# EAGLE design mainboard (EAGLE 7.2.0)
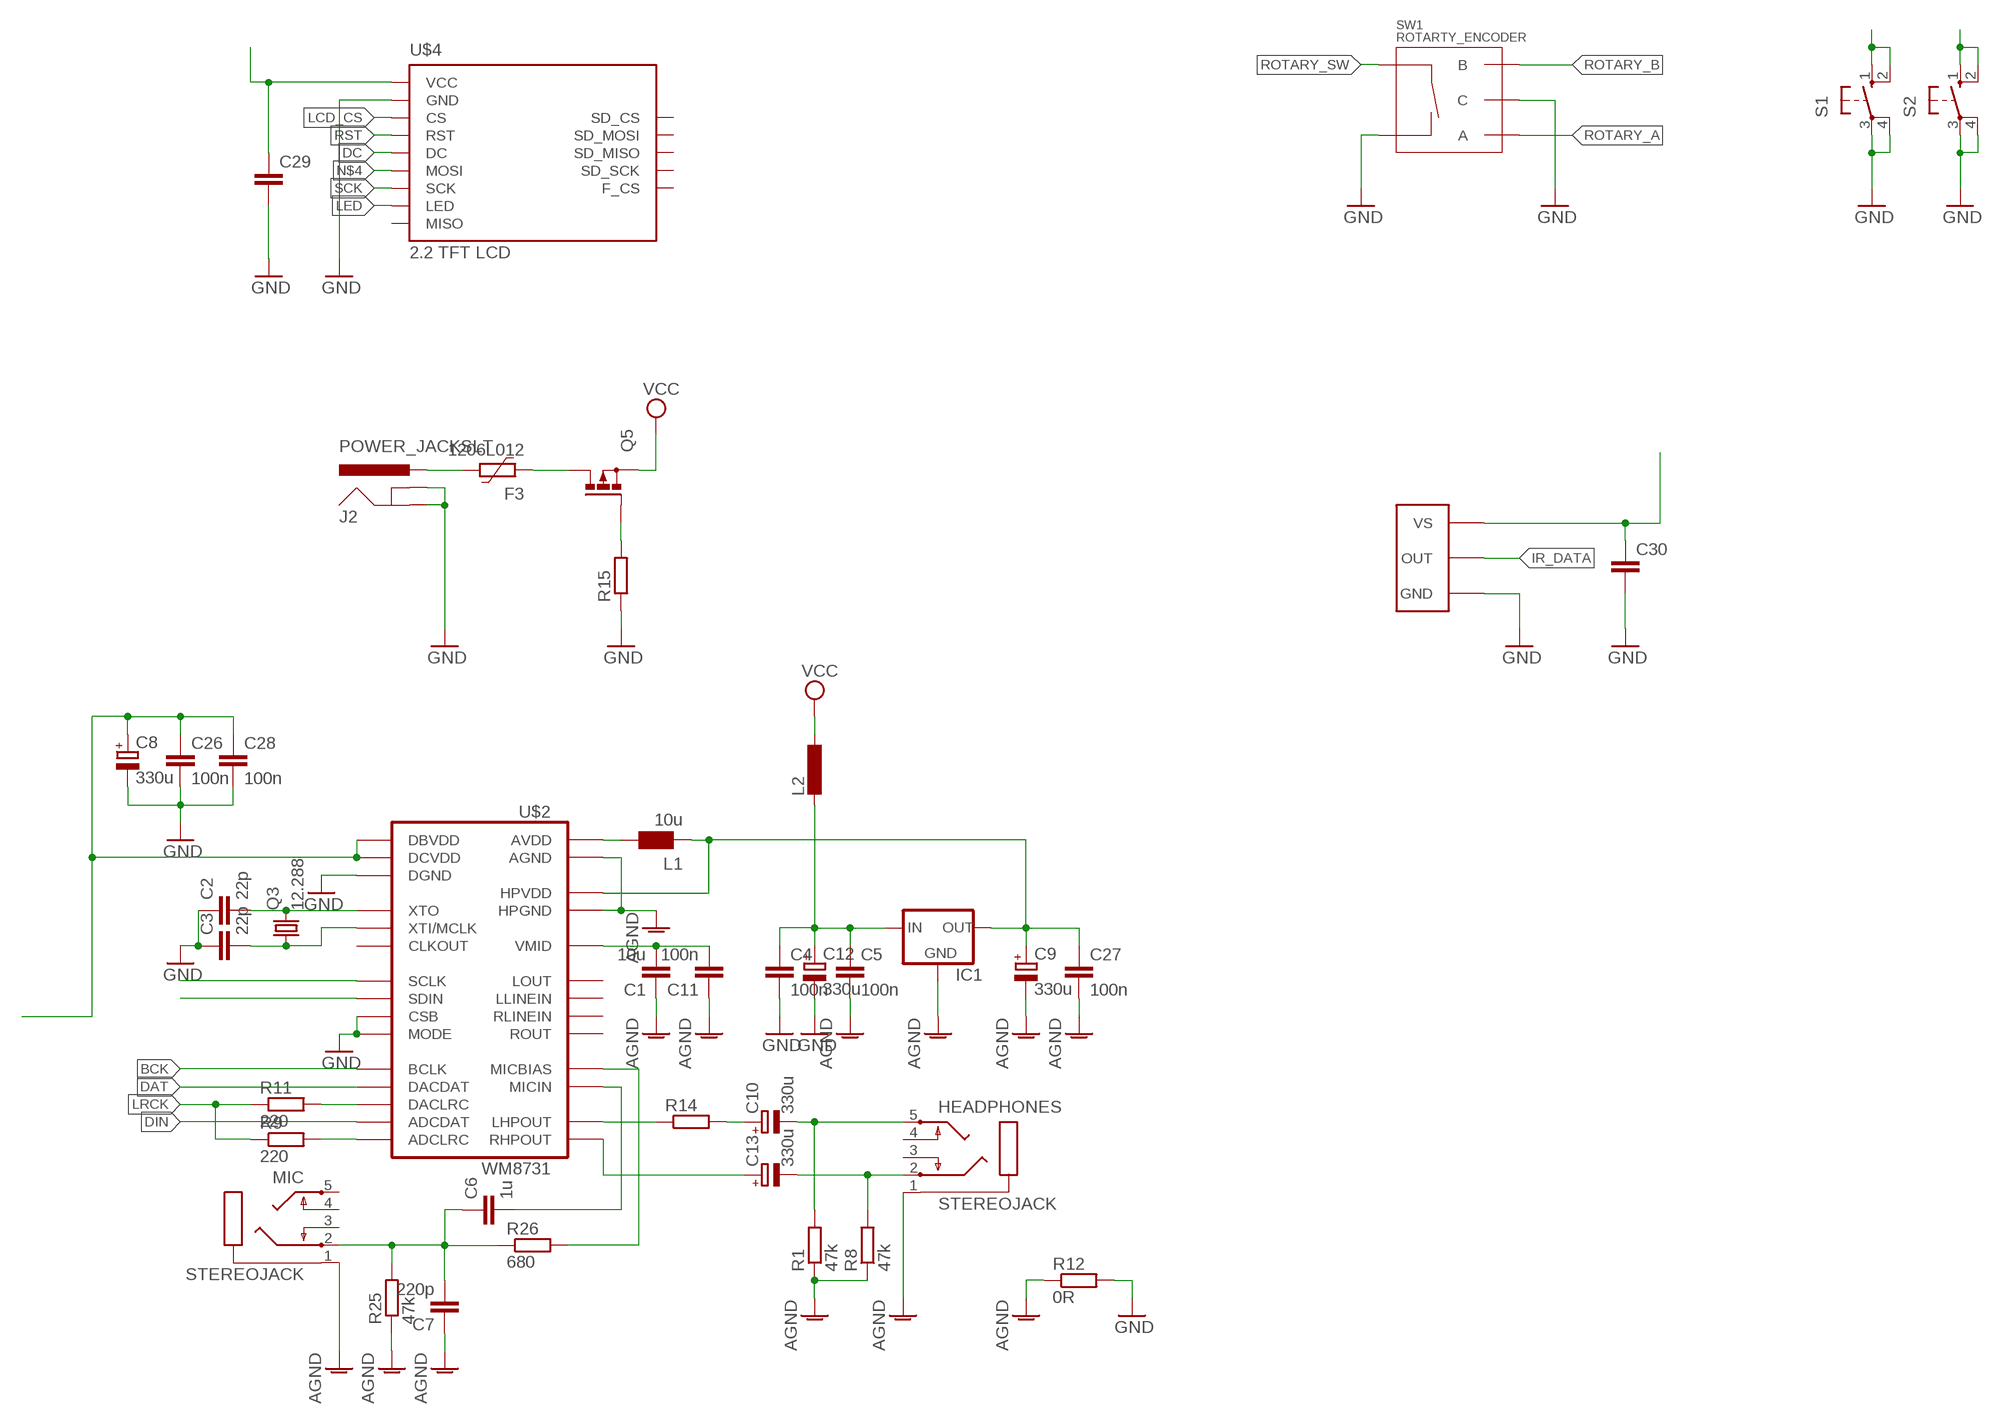
[diagram p0: schematic, sheet 1, part 1 of 2]
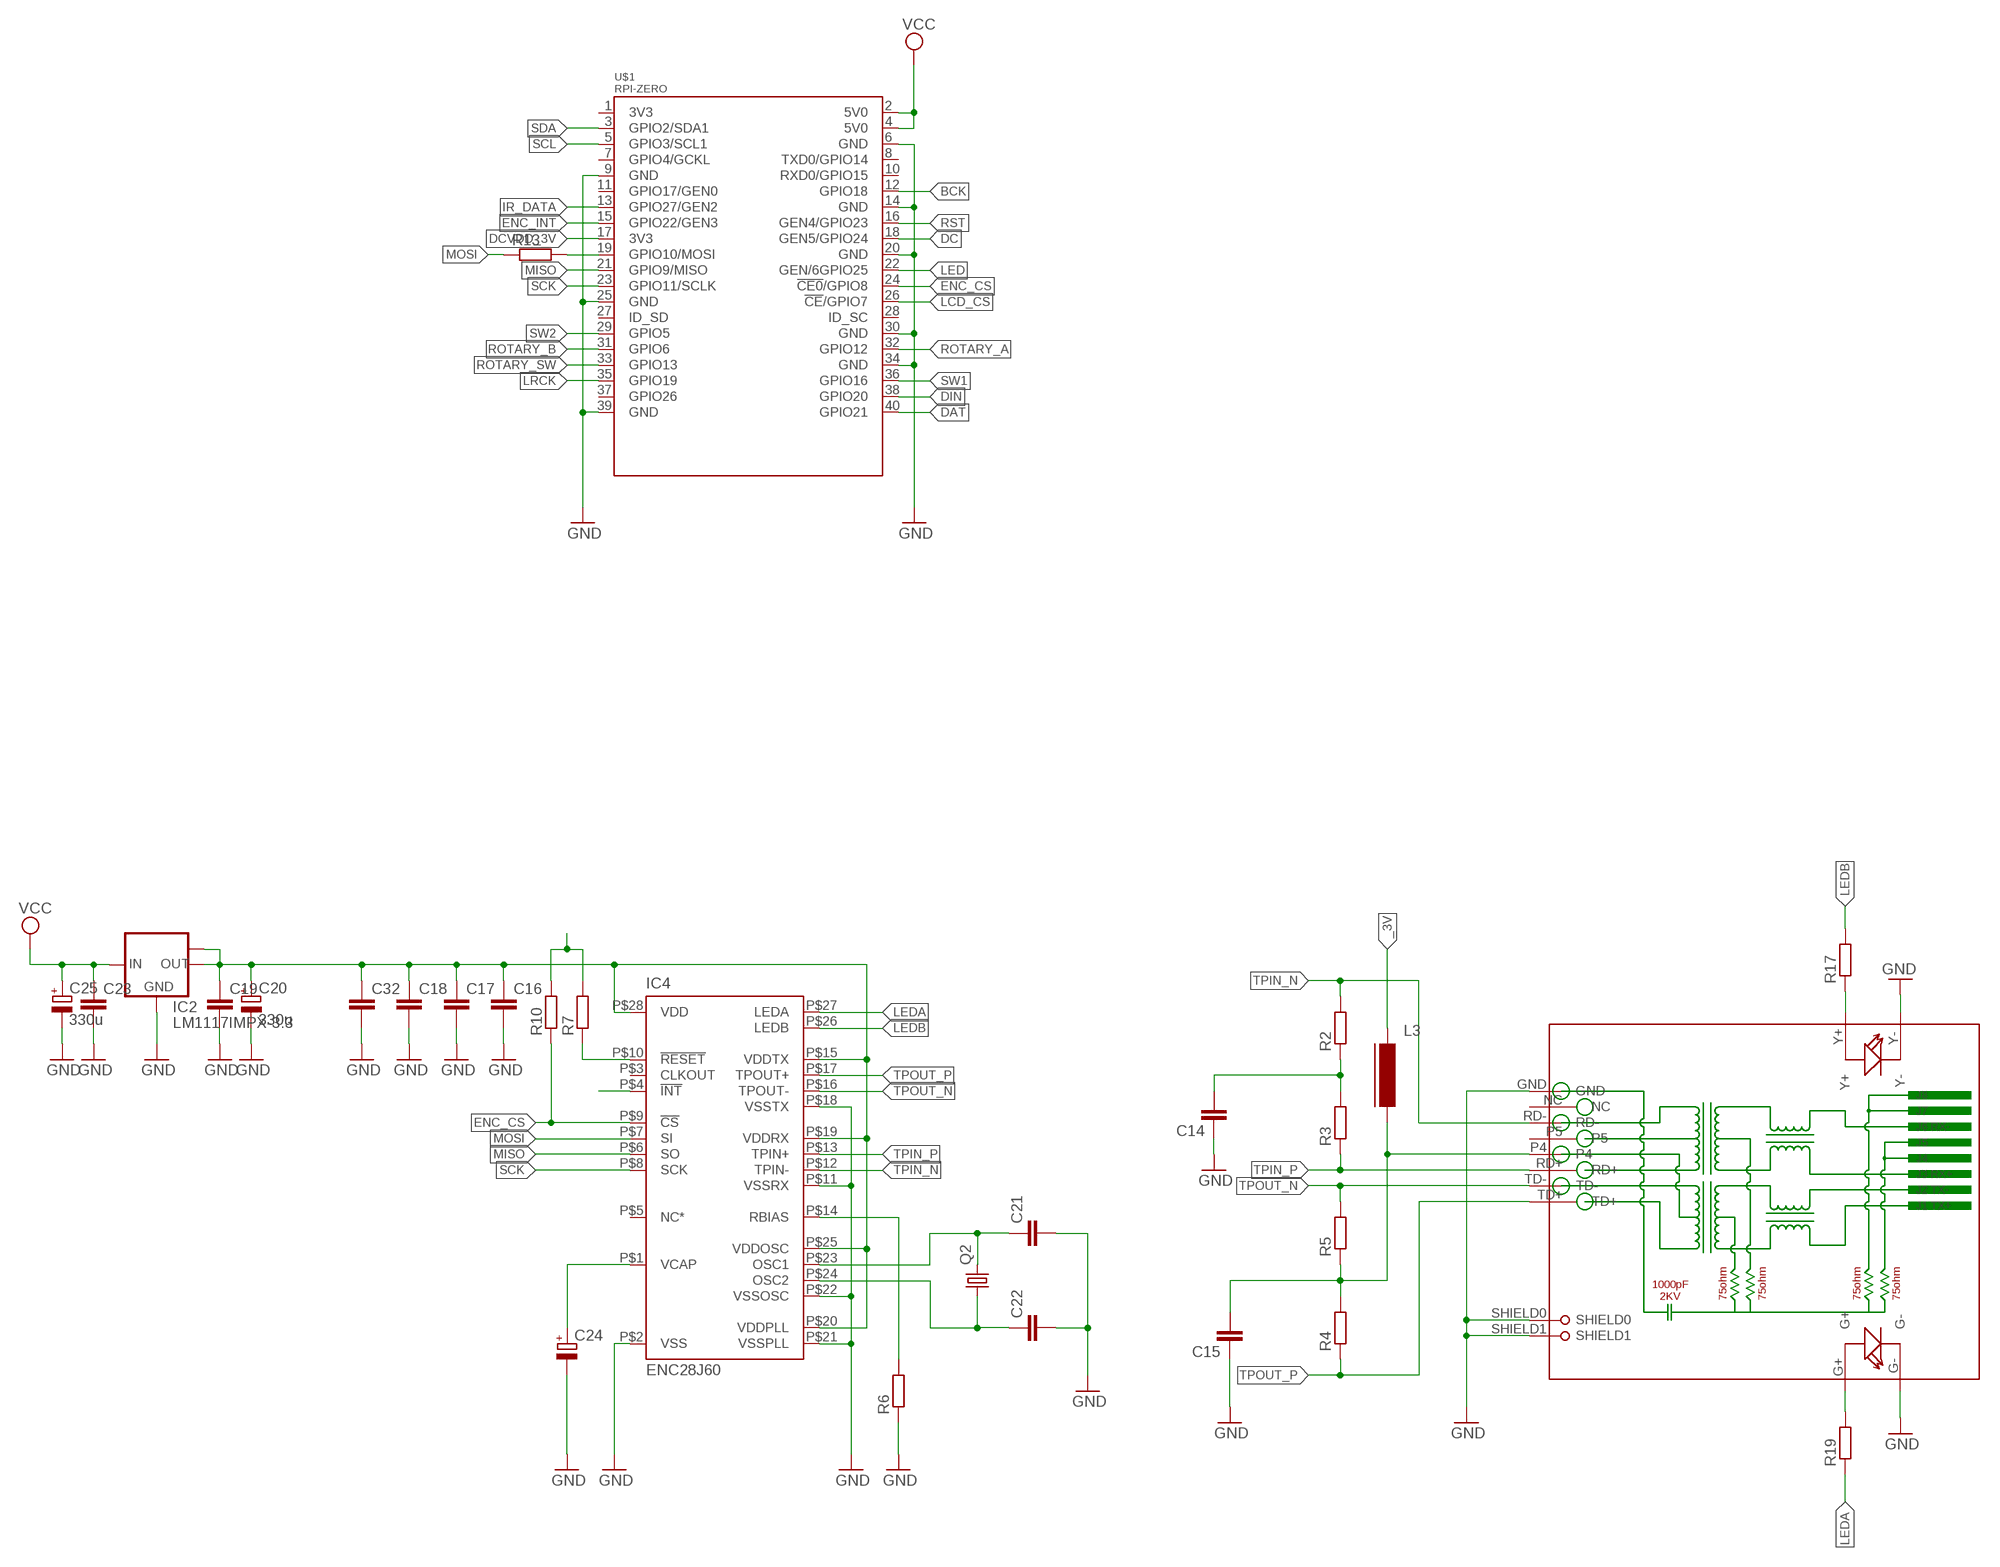
[diagram p1: schematic, sheet 1, part 2 of 2]

## Parts
C1  10u  C-EUC0603  [C0603]
C2  22p  C-EUC0603  [C0603]
C3  22p  C-EUC0603  [C0603]
C4  100n  C-EUC0603  [C0603]
C5  100n  C-EUC0603  [C0603]
C6  1u  C-EUC0603  [C0603]
C7  220p  C-EUC0603  [C0603]
C8  330u  CPOL-EUSMCB  [SMC_B]
C9  330u  CPOL-EUSMCB  [SMC_B]
C10  330u  CPOL-EUE3.5-8  [E3,5-8]
C11  100n  C-EUC0603  [C0603]
C12  330u  CPOL-EUSMCB  [SMC_B]
C13  330u  CPOL-EUE3.5-8  [E3,5-8]
C14  C-EUC0603  [C0603]
C15  C-EUC0603  [C0603]
C16  C-EUC0402  [C0402]
C17  C-EUC0402  [C0402]
C18  C-EUC0402  [C0402]
C19  C-EUC0603  [C0603]
C20  330u  CPOL-EUSMCB  [SMC_B]
C21  C-EUC0603  [C0603]
C22  C-EUC0603  [C0603]
C23  C-EUC0603  [C0603]
C24  CPOL-EUSMCA  [SMC_A]
C25  330u  CPOL-EUSMCB  [SMC_B]
C26  100n  C-EUC0603  [C0603]
C27  100n  C-EUC0603  [C0603]
C28  100n  C-EUC0603  [C0603]
C29  C-EUC0603  [C0603]
C30  C-EUC0603  [C0603]
C32  C-EUC0402  [C0402]
F3  1206L012  [1206L]
HEADPHONES  STEREOJACK  [STX3100]
IC1  78LXXREV  [78LXX_REV]
IC2  LM1117IMPX-3.3  [SOT223]
IC4  ENC28J60  [TSSOP28W]
J2  POWER_JACKSLT  [POWER_JACK_SLOT]
L1  10u  WE-KI_0805_B  [WE-KI_0805_B]
L2  L-EU0204/7  [0204/7]
L3  FERRITE-0805  [FB805]
MIC  STEREOJACK  [STX3100]
Q2  CRYSTALHC49S  [HC49/S]
Q3  12.288  CRYSTALHC49U70  [HC49U70]
Q5  P-MOSFET-SO8  [SO-08]
R1  47k  R-EU_R0603  [R0603]
R2  R-EU_R0603  [R0603]
R3  R-EU_R0603  [R0603]
R4  R-EU_R0603  [R0603]
R5  R-EU_R0603  [R0603]
R6  R-EU_0204/7  [0204/7]
R7  R-EU_0204/7  [0204/7]
R8  47k  R-EU_R0603  [R0603]
R9  220  R-EU_R0402  [R0402]
R10  R-EU_0204/5  [0204/5]
R11  220  R-EU_R0603  [R0603]
R12  0R  R-EU_R0805  [R0805]
R13  R-EU_R0603  [R0603]
R14  R-EU_R1206  [R1206]
R15  R-EU_R0603  [R0603]
R17  R-EU_R0603  [R0603]
R19  R-EU_R0603  [R0603]
R25  47k  R-EU_R0603  [R0603]
R26  680  R-EU_R0603  [R0603]
RJ1  HR911105A  [HR911105A]
S1  40-XX  [B3F-40XX]
S2  40-XX  [B3F-40XX]
SW1  ROTARTY_ENCODER  [ROTARY_ENC_PLAIN]
U$1  RPI-ZERO  [RASPBERRYPI_BASTELSTUBE_V13_RASPI_BOARD_B+_FULL]
U$2  WM8731  [28-SSOP]
U$4  2.2_TFT_LCD  [2.2_TFT_LCD]
U$5  TSOP312XVERTICAL  [TSOP312X_VERT]

## Nets
_3V: C16.1 C17.1 C18.1 C19.1 C20.+ C29.1 C30.1 C32.1 IC2.2(OUT) IC2.TAB(OUT1) IC4.P$15(VDDTX) IC4.P$19(VDDRX) IC4.P$20(VDDPLL) IC4.P$25(VDDOSC) IC4.P$28(VDD) L3.1 U$4.VCC U$5.2(VS)
AGND: C1.1 C5.2 C7.1 C9.- C11.1 C27.2 HEADPHONES.1 IC1.GND MIC.1 R1.1 R8.1 R12.1 R25.1 U$2.P$11(HPGND) U$2.P$15(AGND)
BCK: U$1.12(GPIO18) U$2.P$3(BCLK)
DAT: U$1.40(GPIO21) U$2.P$4(DACDAT)
DC: U$1.18(GEN5/GPIO24) U$4.DC
DCVDD_3V: C8.+ C26.1 C28.1 R7.2 R10.2 U$1.17(3V3) U$2.P$1(DBVDD) U$2.P$27(DCVDD)
DIN: U$1.38(GPIO20) U$2.P$6(ADCDAT)
ENC_CS: IC4.P$9(!CS) R10.1 U$1.24(!CE0!/GPIO8)
ENC_INT: IC4.P$4(!INT) U$1.15(GPIO22/GEN3)
ENC_RST: IC4.P$10(!RESET) R7.1
GND: C2.1 C3.1 C4.2 C8.- C12.- C14.1 C15.1 C16.2 C17.2 C18.2 C19.2 C20.- C21.2 C22.2 C23.2 C24.- C25.- C26.2 C28.2 C29.2 C30.2 C32.2 IC2.1(GND) IC4.P$2(VSS) IC4.P$11(VSSRX) IC4.P$18(VSSTX) IC4.P$21(VSSPLL) IC4.P$22(VSSOSC) J2.GND@1(GNDBREAK) J2.GND@2(GND) R6.1 R12.2 R15.1 RJ1.G- RJ1.GND RJ1.SHIELD0 RJ1.SHIELD1 RJ1.Y- S1.3(P) S1.4(P1) S2.3(P) S2.4(P1) SW1.C SW1.SW- U$1.6(GND) U$1.9(GND) U$1.14(GND) U$1.20(GND) U$1.25(GND) U$1.30(GND) U$1.34(GND) U$1.39(GND) U$2.P$21(MODE) U$2.P$22(CSB) U$2.P$28(DGND) U$4.GND U$5.1(GND)
IR_DATA: U$1.13(GPIO27/GEN2) U$5.3(OUT)
LCD_CS: U$1.26(!CE!/GPIO7) U$4.CS
LED: U$1.22(GEN/6GPIO25) U$4.LED
LEDA: IC4.P$27(LEDA) R19.1
LEDB: IC4.P$26(LEDB) R17.2
LRCK: R9.1 R11.1 U$1.35(GPIO19)
MISO: IC4.P$6(SO) U$1.21(GPIO9/MISO)
MOSI: IC4.P$7(SI) R13.1
N$1: R26.2 U$2.P$17(MICBIAS)
N$2: C14.2 R2.1 R3.2
N$3: R14.1 U$2.P$9(LHPOUT)
N$4: R13.2 U$1.19(GPIO10/MOSI) U$4.MOSI
N$5: F3.2 Q5.5(D) Q5.6(D) Q5.7(D) Q5.8(D)
N$6: C15.2 L3.2 R4.2 R5.1 RJ1.P4
N$7: C4.1 C5.1 C12.+ IC1.IN L2.2
N$8: C10.+ R14.2
N$9: F3.1 J2.PWR
N$11: C2.2 Q3.2 U$2.P$26(XTO)
N$12: IC4.P$14(RBIAS) R6.2
N$13: C3.2 Q3.1 U$2.P$25(XTI/MCLK)
N$14: C10.- HEADPHONES.5 R1.2
N$22: C21.1 IC4.P$23(OSC1) Q2.2
N$23: C22.1 IC4.P$24(OSC2) Q2.1
N$26: Q5.4(G) R15.2
N$29: C24.+ IC4.P$1(VCAP)
N$30: R17.1 RJ1.Y+
N$31: R19.2 RJ1.G+
N$34: C9.+ C27.1 IC1.OUT L1.2 U$2.P$8(HPVDD)
N$40: R11.2 U$2.P$5(DACLRC)
N$42: R9.2 U$2.P$7(ADCLRC)
N$44: C1.2 C11.2 U$2.P$16(VMID)
N$45: C13.- HEADPHONES.2 R8.2
N$46: L1.1 U$2.P$14(AVDD)
N$53: C13.+ U$2.P$10(RHPOUT)
N$54: C6.2 U$2.P$18(MICIN)
N$55: C6.1 C7.2 MIC.2 R25.2 R26.1
ROTARY_A: SW1.A U$1.32(GPIO12)
ROTARY_B: SW1.B U$1.31(GPIO6)
ROTARY_SW: SW1.SW+ U$1.33(GPIO13)
RST: U$1.16(GEN4/GPIO23) U$4.RST
SCK: IC4.P$8(SCK) U$1.23(GPIO11/SCLK) U$4.SCK
SCL: U$1.5(GPIO3/SCL1) U$2.P$24(SCLK)
SDA: U$1.3(GPIO2/SDA1) U$2.P$23(SDIN)
SW1: S1.1(S) S1.2(S1) U$1.36(GPIO16)
SW2: S2.1(S) S2.2(S1) U$1.29(GPIO5)
TPIN_N: IC4.P$12(TPIN-) R2.2 RJ1.RD-
TPIN_P: IC4.P$13(TPIN+) R3.1 RJ1.RD+
TPOUT_N: IC4.P$16(TPOUT-) R5.2 RJ1.TD-
TPOUT_P: IC4.P$17(TPOUT+) R4.1 RJ1.TD+
VCC: C23.1 C25.+ IC2.3(IN) L2.1 Q5.1(S) Q5.2(S) Q5.3(S) U$1.2(5V0) U$1.4(5V0)
Unconnected: HEADPHONES.3 HEADPHONES.4 IC4.P$3(CLKOUT) IC4.P$5(NC*) MIC.3 MIC.4 MIC.5 RJ1.NC RJ1.P5 U$1.1(3V3) U$1.7(GPIO4/GCKL) U$1.8(TXD0/GPIO14) U$1.10(RXD0/GPIO15) U$1.11(GPIO17/GEN0) U$1.27(ID_SD) U$1.28(ID_SC) U$1.37(GPIO26) U$2.P$2(CLKOUT) U$2.P$12(LOUT) U$2.P$13(ROUT) U$2.P$19(RLINEIN) U$2.P$20(LLINEIN) U$4.F_CS U$4.MISO U$4.SD_CS U$4.SD_MISO U$4.SD_MOSI U$4.SD_SCK

## Library data of the parts
C1-C7 C11 C14-C19 C21-C23 C26-C30 C32 = rcl:C-EU: CAPACITOR, European symbol
C8-C10 C12 C13 C20 C24 C25 = rcl:CPOL-EU: POLARIZED CAPACITOR, European symbol
F3 = polyfuse-smd_10:?: Polyfuse Resettable PTC Source: http://www.littelfuse.com/products/resettable-ptcs.aspx; MF: Littelfuse; MPN: 1206L012; OC_FARNELL: 1596988; OC_NEWARK: 05M2298
HEADPHONES MIC = adafruit:STEREOJACK: MIC/HEADPHONE JACK Stereo jack with two switches. Kycon STX3100, CUI SJ1-3555NG and/or 4UCon 05544
IC1 = v-reg:78LXX: VOLTAGE REGULATOR
IC2 = lm1117:LM1117IMPX-*
IC4 = microchip:ENC28J60: Stand-Alone Ethernet Controller with SPI Interface Source: http://ww1.microchip.com/downloads/en/DeviceDoc/39662c.pdf
J2 = SparkFun-Connectors:POWER_JACK: Power Jack This is the standard 5.5mm barrel jack for power. The PTH is the most common, proven, reliable, footprint. The Slot footprint only works if the mill layer is transmitted to the PCB fab house so be warned. Mating wall wart : TOL-00298 (and others); PROD_ID: PRT-00119
L1 = wuerth-elektronik:WE-KI: SMD Wire Wound Ceramic Inductor WE-KI - Wire wound - High thermal stability - Rated current up to 1 A - High Q-factor - High SRF -- Especially developed for high frequency applications -- Perfect for applications in telecommunications -- Bluetooth -- Wireless LAN
L2 = rcl:L-EU: INDUCTOR, European symbol
L3 = dp_devices:FERRITE: Ferrite bead in various packages
Q2 = crystal:CRYSTAL: CRYSTAL; OC_FARNELL: 1667008; OC_NEWARK: unknown
Q3 = crystal:CRYSTAL: CRYSTAL; OC_FARNELL: unknown; OC_NEWARK: unknown
Q5 = transistor-power:P-MOSFET-SO8: P-Channel MOSFET Example: FDS4435A; P-Channel Logic Level PowerTrench® MOSFET FDS4465; P-Channel 1.8V Specified PowerTrench® MOSFET Source: www.fairchildsemi.com
R1-R15 R17 R19 R25 R26 = rcl:R-EU_: RESISTOR, European symbol
RJ1 = hanrun:HR911105A
S1 S2 = switch-omron:40-XX: OMRON SWITCH; MF: OMRON COMPONENTS USA; MPN: B3F-4000; OC_FARNELL: 176434; OC_NEWARK: 36K3105
SW1 = SparkFun-Electromechanical:ROTARTY_ENCODER: Simple no LED rotary encoder Example: COM-09117
U$1 = RPI-Zero:RPI-ZERO
U$2 = microdecv1:WM8731
U$4 = aldar:2.2_TFT_LCD
U$5 = Simplex-ICs:TSOP312X: TSOP ir receiver module for remote control systems

## Board
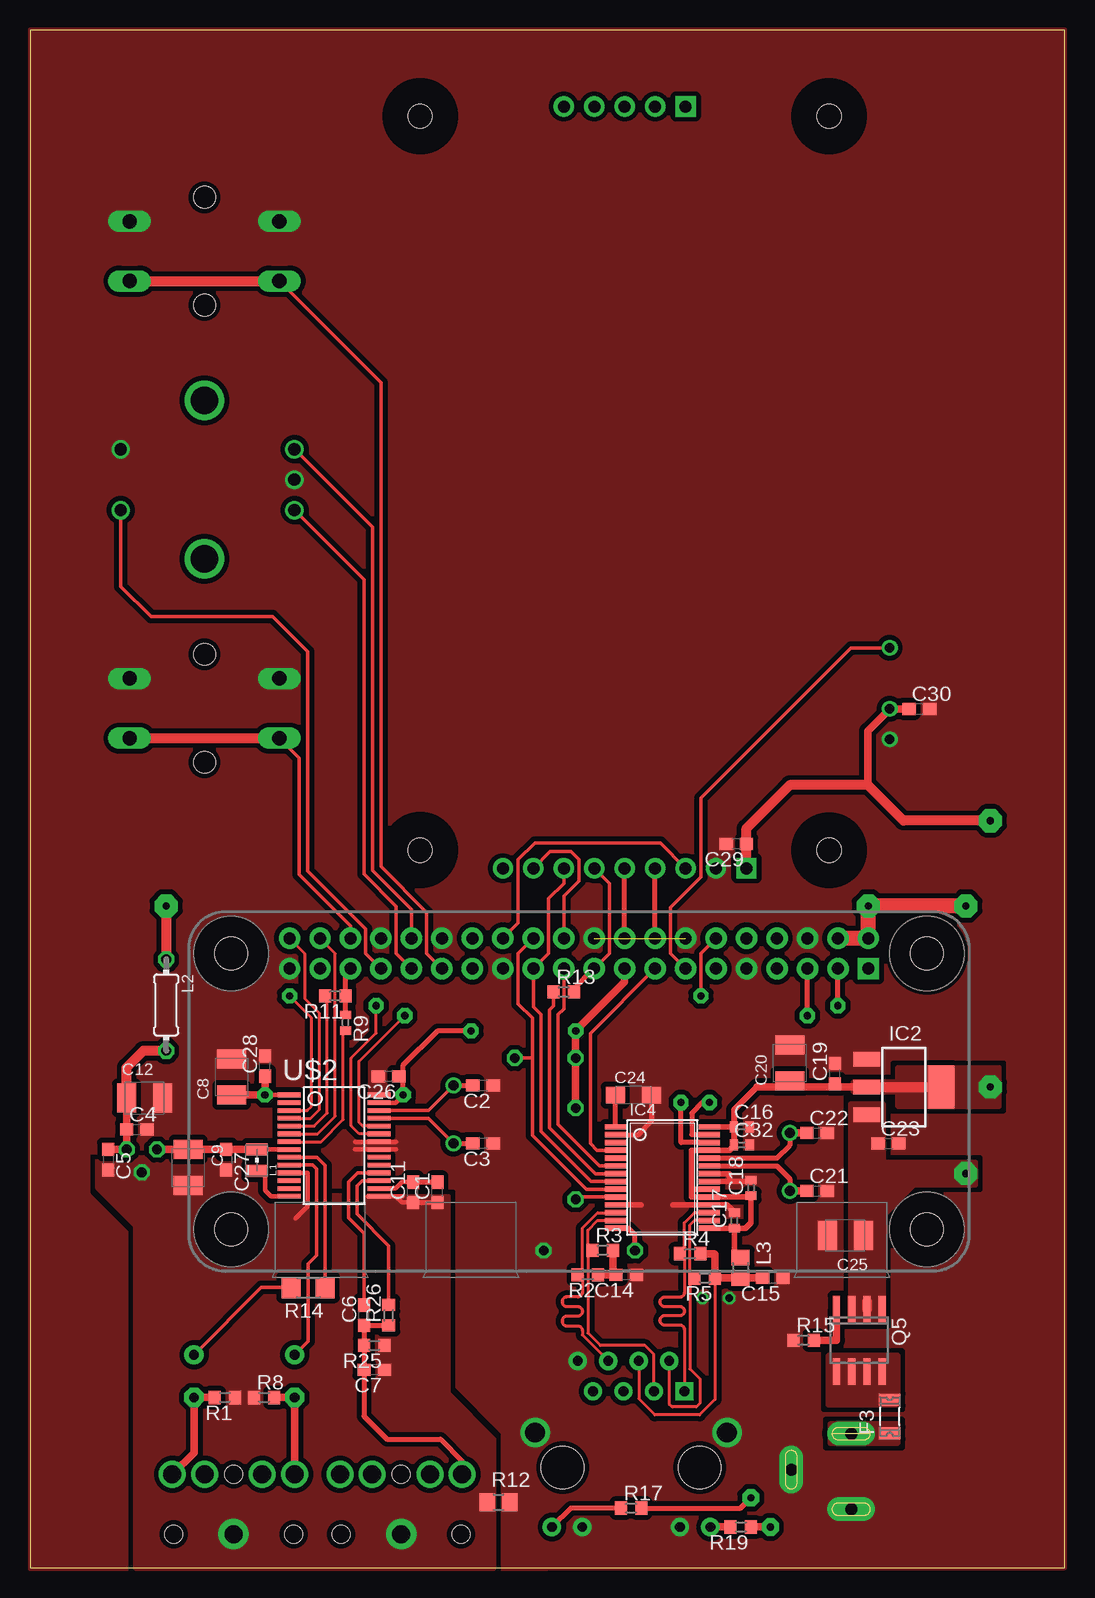
[diagram p2: board, top side]
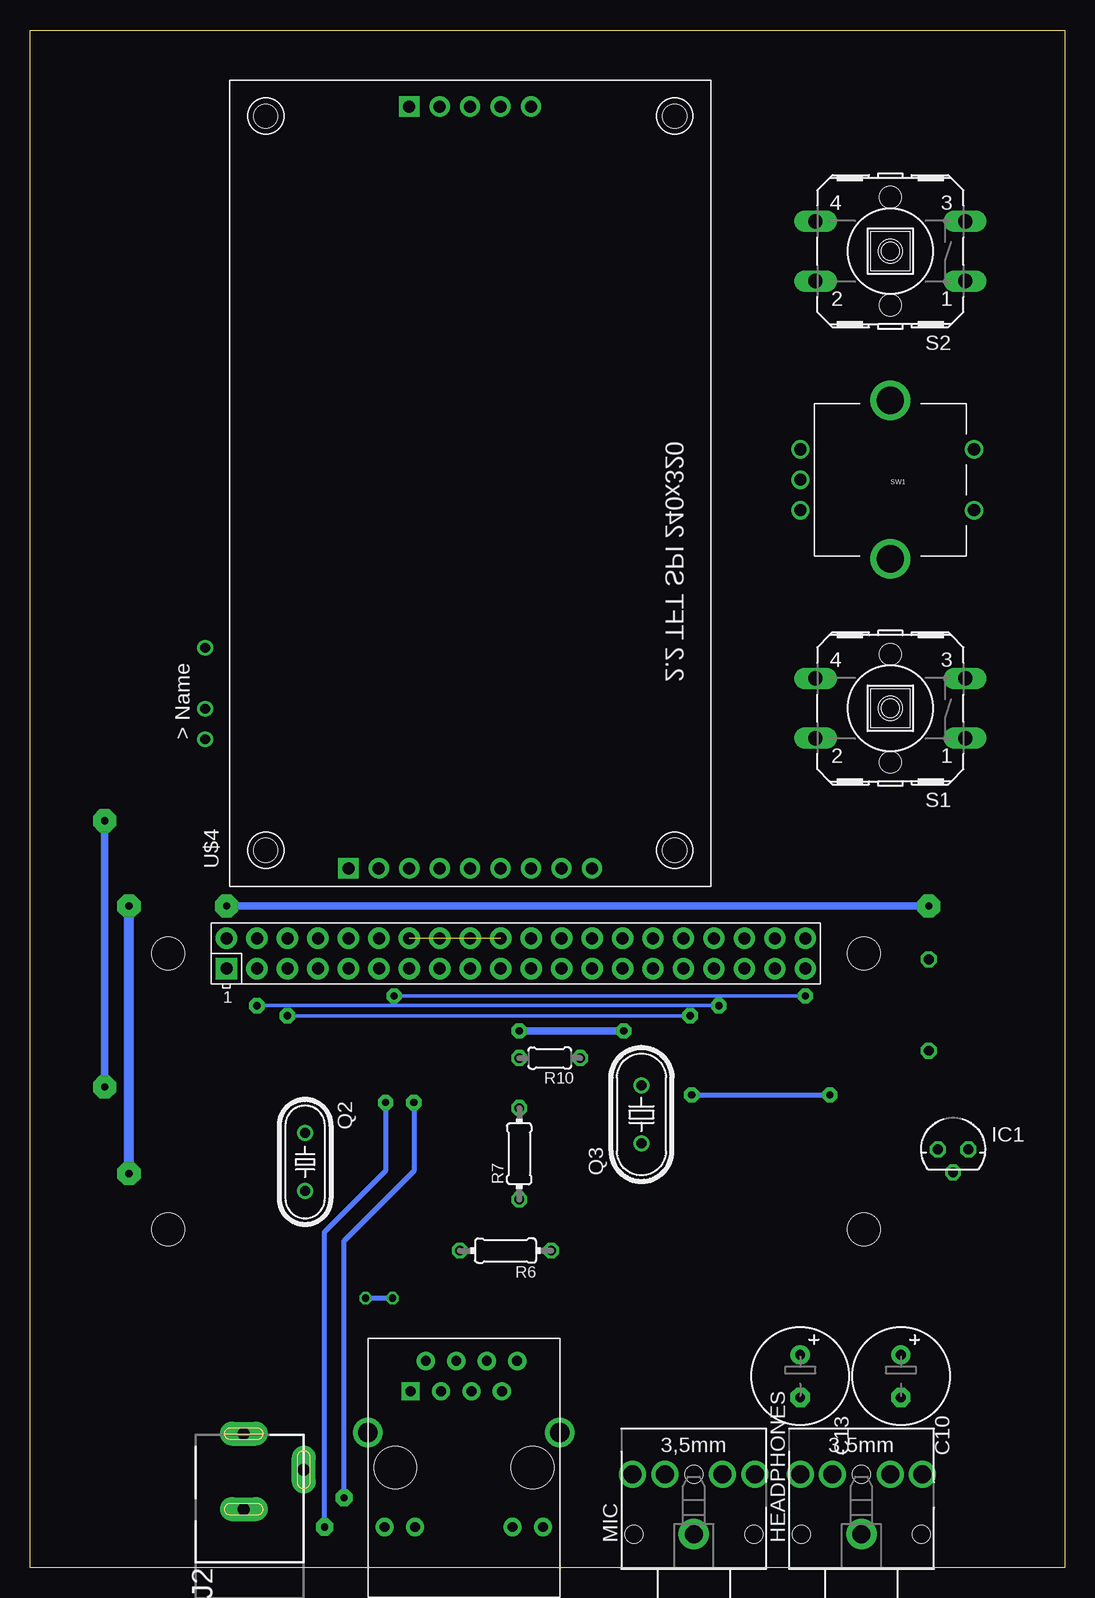
[diagram p3: board, bottom side, seen from below]

Size 86.28 x 128.18 mm. Coordinates in mm from the lower left corner, seen from the top.
Outline: 86.28,128.18 0,128.18 0,0 86.28,0 86.28,128.18
Copper layers (1*16): Top 0.035mm / dielectric 1.5mm / Bottom 0.035mm
Design rules "default *": minimum track width 10mil, minimum drill 24mil, track to track 8mil, track to pad 8mil, pad to pad 8mil, via to via 8mil, smd to smd 8mil, copper to edge 0mil, drill to drill 8mil, minimum pad ring 10mil, minimum via ring 8mil, stop-mask expansion 4mil, vias tented up to drill 0mil, thermal gap 10mil
tRestrict: area 55.8,28.1 to 57.6,37; area 47.9,28.1 to 49.7,37; area 72.2,25.6 to 77.3,30.7; area 72,48.4 to 77.6,54; area 14.2,48.7 to 19.3,53.7; area 14.2,25.6 to 19.3,30.7; area 30,57.3 to 35.1,62.4; area 30,118.5 to 35.1,123.5; area 64.1,118.5 to 69.2,123.5; area 64.1,57.3 to 69.2,62.3

### Footprints (pad centres in the part's own frame; a part is rotated, then mirrored left to right if it is on the bottom)
C0603 = smd 1.1 x 1: 1 -0.85,0; 2 0.85,0
SMC_B = smd 1.6 x 2.4: + -1.5,0; - 1.5,0
E3,5-8 = drill 0.813 pad 1.6: + -1.778,0 | drill 0.813 pad 1.6 octagon: - 1.778,0
C0402 = smd 0.7 x 0.9: 1 -0.65,0; 2 0.65,0
SMC_A = smd 1.6 x 1.4: + -1.5,0; - 1.5,0
1206L = smd 1 x 1.8: 1 -1.4,0; 2 1.4,0
STX3100 = drill 1.5 pad 2.54: 1 2.7,-0.1 | drill 1.5: 2 7.7,5; 3 7.7,2.3; 4 7.7,-2.5; 5 7.7,-5.2 | hole 1.5: 2.7,4.9; 2.7,-5.1; 7.7,-0.1
78LXX_REV = drill 0.813 octagon: GND 0,-1.905; IN 1.27,0; OUT -1.27,0
SOT223 = smd 1.219 x 2.235: 1 -2.311,-3.099; 2 0,-3.099; 3 2.311,-3.099 | smd 3.6 x 2.2: TAB 0,3.099
TSSOP28W = smd 0.45 x 1.75: P$1 0,-0.65; P$2 0.65,-0.65; P$3 1.3,-0.65; P$4 1.95,-0.65; P$5 2.6,-0.65; P$6 3.25,-0.65; P$7 3.9,-0.65; P$8 4.55,-0.65; P$9 5.2,-0.65; P$10 5.85,-0.65; P$11 6.5,-0.65; P$12 7.15,-0.65; P$13 7.8,-0.65; P$14 8.45,-0.65; P$15 8.45,7.2; P$16 7.8,7.2; P$17 7.15,7.2; P$18 6.5,7.2; P$19 5.85,7.2; P$20 5.2,7.2; P$21 4.55,7.2; P$22 3.9,7.2; P$23 3.25,7.2; P$24 2.6,7.2; P$25 1.95,7.2; P$26 1.3,7.2; P$27 0.65,7.2; P$28 0,7.2
POWER_JACK_SLOT = drill 1 pad 2 long: GND@1 2.58,7.5; GND@2 7.58,10.8; PWR 2.58,13.8
WE-KI_0805_B = smd 1.02 x 1.78: 1 -0.89,0; 2 0.89,0
0204/7 = drill 0.813 octagon: 1 -3.81,0; 2 3.81,0
FB805 = smd 1.3 x 1.5: 1 -0.85,0; 2 0.85,0
HC49/S = drill 0.813: 1 -2.413,0; 2 2.413,0
HC49U70 = drill 0.813: 1 -2.413,0; 2 2.413,0
SO-08 = smd 0.6 x 2.2: 1 -1.905,-2.6; 2 -0.635,-2.6; 3 0.635,-2.6; 4 1.905,-2.6; 5 1.905,2.6; 6 0.635,2.6; 7 -0.635,2.6; 8 -1.905,2.6
R0603 = smd 1 x 1.1: 1 -0.85,0; 2 0.85,0
R0402 = smd 0.7 x 0.9: 1 -0.65,0; 2 0.65,0
0204/5 = drill 0.813 octagon: 1 -2.54,0; 2 2.54,0
R0805 = smd 1.3 x 1.5: 1 -0.95,0; 2 0.95,0
R1206 = smd 1.6 x 1.803: 1 -1.422,0; 2 1.422,0
HR911105A = drill 0.813 pad 1.524: G+ 4.953,-6.604; G- 4.953,-4.064; GND -8.89,4.445; NC -6.35,3.175; P4 -8.89,-0.635; P5 -6.35,0.635; RD+ -6.35,-1.905; RD- -8.89,1.905; TD- -8.89,-3.175; Y+ 4.953,6.604; Y- 4.953,4.064 | drill 1.651 pad 2.159: SHIELD0 -2.921,8.001; SHIELD1 -2.921,-8.001 | drill 0.813 pad 1.524 square: TD+ -6.35,-4.445 | hole 3.556: 0,-5.715; 0,5.715
B3F-40XX = drill 1.194 long: 1 -6.248,2.489; 2 6.248,2.489; 3 -6.248,-2.489; 4 6.248,-2.489 | hole 1.803: 0,-4.496; 0,4.496
ROTARY_ENC_PLAIN = drill 1.016: A 7.493,-2.54; B 7.493,2.54; C 7.493,0; SW+ -6.985,2.54; SW- -6.985,-2.54 | drill 2.286: P$3 0,6.604; P$4 0,-6.604
RASPBERRYPI_BASTELSTUBE_V13_RASPI_BOARD_B+_FULL = drill 1 pad 1.778 square: 1 8.37,25.23 | drill 1 pad 1.778: 2 8.37,27.77; 3 10.91,25.23; 4 10.91,27.77; 5 13.45,25.23; 6 13.45,27.77; 7 15.99,25.23; 8 15.99,27.77; 9 18.53,25.23; 10 18.53,27.77; 11 21.07,25.23; 12 21.07,27.77; 13 23.61,25.23; 14 23.61,27.77; 15 26.15,25.23; 16 26.15,27.77; 17 28.69,25.23; 18 28.69,27.77; 19 31.23,25.23; 20 31.23,27.77; 21 33.77,25.23; 22 33.77,27.77; 23 36.31,25.23; 24 36.31,27.77; 25 38.85,25.23; 26 38.85,27.77; 27 41.39,25.23; 28 41.39,27.77; 29 43.93,25.23; 30 43.93,27.77; 31 46.47,25.23; 32 46.47,27.77; 33 49.01,25.23; 34 49.01,27.77; 35 51.55,25.23; 36 51.55,27.77; 37 54.09,25.23; 38 54.09,27.77; 39 56.63,25.23; 40 56.63,27.77 | hole 2.75: 3.5,3.5; 3.5,26.5; 61.5,3.5; 61.5,26.5
28-SSOP = smd 0.381 x 1.905: P$1 -4.55,-3.752; P$2 -3.9,-3.752; P$3 -3.25,-3.752; P$4 -2.6,-3.752; P$5 -1.95,-3.752; P$6 -1.3,-3.752; P$7 -0.65,-3.752; P$8 0,-3.752; P$9 0.65,-3.752; P$10 1.3,-3.752; P$11 1.95,-3.752; P$12 2.6,-3.752; P$13 3.25,-3.752; P$14 3.9,-3.752; P$15 3.9,3.752; P$16 3.25,3.752; P$17 2.6,3.752; P$18 1.95,3.752; P$19 1.3,3.752; P$20 0.65,3.752; P$21 0,3.752; P$22 -0.65,3.752; P$23 -1.3,3.752; P$24 -1.95,3.752; P$25 -2.6,3.752; P$26 -3.25,3.752; P$27 -3.9,3.752; P$28 -4.55,3.752
2.2_TFT_LCD = drill 1 pad 1.676: CS 0,-5.08; DC 0,-10.16; F_CS 63.5,-15.24; GND 0,-2.54; LED 0,-17.78; MISO 0,-20.32; MOSI 0,-12.7; RST 0,-7.62; SCK 0,-15.24; SD_MISO 63.5,-10.16; SD_MOSI 63.5,-7.62; SD_SCK 63.5,-12.7 | drill 1 pad 1.676 square: SD_CS 63.5,-5.08; VCC 0,0 | hole 2: 1.5,6.89; 62.7,6.89; 62.7,-27.21; 1.5,-27.21
TSOP312X_VERT = drill 0.8: 1 -3.81,0; 2 -1.27,0; 3 3.81,0

### Placement (x,y rotation side)
C1  33.96,31.29 90 top
C2  37.77,40.19 180 top
C3  37.77,35.37 180 top
C4  8.9,36.54 0 top
C5  6.5,34.01 270 top
C6  27.87,21.04 90 top
C7  28.7,16.5 180 top
C8  16.82,40.91 90 top
C9  13.18,33.36 270 top
C10  13.67,15.96 270 bottom
C11  31.93,31.29 90 top
C12  9.55,39.15 0 top
C13  22.07,15.96 270 bottom
C14  49.71,24.42 180 top
C15  61.93,24.14 180 top
C16  59.34,36.74 0 top
C17  58.72,28.94 90 top
C18  60.11,31.67 90 top
C19  67.11,41.18 90 top
C20  63.35,42.07 90 top
C21  65.61,31.41 0 top
C22  65.61,36.23 0 top
C23  71.56,35.36 0 top
C24  50.3,39.4 0 top
C25  67.97,27.7 180 top
C26  29.9,40.96 180 top
C27  16.37,34.01 270 top
C28  19.59,41.82 90 top
C29  58.89,60.34 180 top
C30  74.14,71.59 0 top
C32  59.34,35.24 0 top
F3  71.68,12.61 90 top
HEADPHONES  17.07,0.09 90 bottom
IC1  9.32,34.86 0 bottom
IC2  72.85,40.07 270 top
IC4  49.45,36.74 270 top
J2  71.05,-2.63 0 bottom
L1  18.92,33.97 90 top
L2  11.36,46.9 270 top
L3  59.24,24.99 270 top
MIC  31.04,0.09 90 bottom
Q2  63.35,33.82 270 bottom
Q3  35.31,37.78 90 bottom
Q5  69.14,18.96 180 top
R1  16.25,14.18 180 top
R2  46.51,24.42 180 top
R3  47.75,26.45 0 top
R4  55.03,26.17 0 top
R5  56.26,24.14 180 top
R6  46.64,26.43 180 bottom
R7  45.49,34.5 90 bottom
R8  19.52,14.18 0 top
R9  26.3,45.43 270 top
R10  42.95,42.48 180 bottom
R11  25.45,47.66 180 top
R12  39.07,5.45 0 top
R13  44.5,47.99 0 top
R14  23.19,23.35 180 top
R15  64.49,18.96 0 top
R17  50.12,4.96 0 top
R19  59.26,3.39 180 top
R25  28.7,18.53 180 top
R26  29.9,21.04 90 top
RJ1  50.12,8.34 270 bottom
S1  14.56,71.64 180 bottom
S2  14.56,109.74 180 bottom
SW1  14.56,90.69 180 bottom
U$1  78.27,24.7 0 bottom
U$2  25.35,34.86 270 top
U$4  59.74,58.3 90 bottom
U$5  71.68,72.86 90 bottom

### Tracks (layer width: path | path; a pad name or v marks a point on that pad's centre or on a via)
_3V  (via drill 0.6 pad 1.93)
  Top 0.305: C29.1 59.74,60.24 59.74,60.23
  Top 0.406: C19.1 67.11,40.19 67.23,40.07 | C20.+ 63.35,40.14 63.42,40.07
  Top 0.457: IC4.P$20 55.14,31.54 | 55.14,31.54 55.14,34.79 IC4.P$25 58.32,34.79 58.69,35.15 C32.1 | IC4.P$28 C16.1 | 55.14,31.54 55.14,30.89 IC4.P$19 60.11,30.89 C18.1 60.11,28.76 59.65,28.29 C17.1 | IC4.P$15 C17.1 | C17.1 58.72,26.32 58.77,26.32 L3.1
  Top 0.508: C32.1 C16.1 58.69,38.16 60.59,40.07
  Top 0.61: IC2.2 67.23,40.07 63.42,40.07 60.59,40.07 | 69.85,65.24 69.85,69.76 U$5.2 C30.1
  Top 0.813: IC2.2 IC2.TAB | U$4.VCC 59.74,60.23 59.74,61.63 63.35,65.24 69.85,65.24 72.82,62.27 v80.06,62.27
  Bottom 0.61: v80.06,40.07 v80.06,62.27
  pour Top (isolate 0.406, no thermals): 68.61,40.47 68.61,39.66 72.31,39.66 72.31,38.47 80.82,38.47 80.82,41.67 72.31,41.67 72.31,40.47
AGND
  Top 0.386: U$2.P$15 30.48,30.96 31,30.44 C11.1 | U$2.P$11 23.15,32.91 23.15,30.12 22.15,29.12 | U$2.P$15 28.14,30.96 | U$2.P$15 31.05,30.96
  Top 0.406: C11.1 C1.1
  pour Top (isolate 0.406, no thermals): 5.64,34.2 19.61,34.2 22.79,31.02 34.85,31.02 34.85,14.52 38.66,10.71 38.66,-0.09 8.82,-0.09 8.82,28.48 5.64,31.66
BCK  (via drill 0.6 pad 1.27)
  Top 0.254: U$2.P$3 23.11,38.11 23.47,38.47 23.47,45.83 v21.64,47.66
  Top 0.305: v55.93,47.66 55.93,51.2 U$1.12
  Bottom 0.305: v55.93,47.66 v21.64,47.66
DAT
  Top 0.254: U$2.P$4 23.4,37.46 24.13,38.19 24.13,46.21 22.91,47.43 22.91,51.2 U$1.40
DC
  Top 0.406: U$1.18 U$4.DC
DCVDD_3V  (via drill 0.6 pad 1.27)
  Top 0.386: v19.59,39.41 U$2.P$1 | U$2.P$27 30.47,38.76 v31.12,39.41
  Top 0.406: v31.12,39.41 31.12,41.18 | 31.12,41.18 31.12,41.9 33.96,44.74 v36.78,44.74 | C26.1 30.89,40.96 31.12,41.18
  Top 0.61: C8.+ v19.59,39.41 C28.1 | U$1.17 49.58,48.83 v45.49,44.74 R10.2 R7.2
  Bottom 0.406: v31.12,39.41 v19.59,39.41
  Bottom 0.61: v45.49,44.74 v36.78,44.74
DIN
  Top 0.254: U$2.P$6 23.98,36.16 25.45,37.63 25.45,51.2 U$1.38
ENC_CS
  Top 0.305: IC4.P$9 46.4,31.54 41.89,36.05 41.89,42.45 | 41.89,42.45 41.89,45.81 40.69,47 40.69,51.2 U$1.24 | R10.1 41.86,42.48 41.89,42.45
ENC_INT
  Top 0.305: IC4.P$4 47.29,34.79 46.71,35.37 46.71,44.52 U$1.15
ENC_RST
  Top 0.305: IC4.P$10 45.69,30.89 R7.1
GND  (via drill 0.6 pad 1.02)  (1 unrouted)
  Top 0.386: 30.53,35.51 U$2.P$22 27.1,35.51 | 27.1,34.86 U$2.P$21 30.53,34.86
  Top 0.406: IC4.P$2 50.71,36.09 51.8,37.18 C24.-
  Top 0.457: IC4.P$11 50.95,30.24 | 53.62,30.24 IC4.P$18 58.09,30.24 58.72,29.61 C17.2 | IC4.P$21 58.32,32.19 | 58.32,32.19 60.11,32.19 C18.2 | IC4.P$22 58.32,32.84 58.32,32.19
  Bottom 0.406: v56.06,22.46 v58.29,22.46
  pour Top (isolate 0.406, rank 2, no thermals): 86.28,0 86.28,128.18 0,128.18 0,-0.09
IR_DATA
  Top 0.305: U$1.13 53.39,51.2 53.39,55.05 55.93,57.59 55.93,64.17 68.43,76.67 U$5.3
LCD_CS
  Top 0.305: U$1.26 40.69,53.74 40.69,59.02 42.09,60.41 52.55,60.41 U$4.CS
LED
  Top 0.305: U$1.22 44.5,55.99 45.77,57.26 45.77,59.02 45.09,59.7 43.36,59.7 U$4.LED
LEDA  (via drill 0.6 pad 1.27, 0.6 pad 1.42)
  Top 0.406: IC4.P$27 55.17,36.09 55.17,37.91 56.03,38.77 v56.64,38.77
  Top 0.61: R19.1 v61.72,3.39
  Bottom 0.406: v61.72,3.39 61.72,27.98 56.64,33.06 v56.64,38.77
LEDB  (via drill 0.6 pad 1.27, 0.6 pad 1.42)
  Top 0.406: IC4.P$26 54.28,35.44 v54.28,38.77 | R17.2 59.23,4.96 v60.1,5.83
  Bottom 0.406: v60.1,5.83 60.1,27.24 54.28,33.06 v54.28,38.77
LRCK
  Top 0.406: U$1.35 26.3,49.51 R11.1 R9.1
MISO
  Top 0.305: IC4.P$6 47.5,33.49 44.02,36.97 44.02,46.11 44.5,46.59 U$1.21
MOSI
  Top 0.305: IC4.P$7 47.13,32.84 43.31,36.66 43.31,46.49 43.65,46.84 R13.1
N$1
  Top 0.305: U$2.P$17 27.68,32.26 27.25,31.84 27.25,29.48 29.9,26.83 R26.2
N$2
  Top 0.61: R3.2 48.6,24.6 48.68,24.6 C14.2 R2.1
N$3
  Top 0.305: U$2.P$9 23.94,34.21 24.61,33.54 R14.1
N$4
  Top 0.305: U$1.19 48.31,51.2 48.31,57.03 U$4.MOSI
  Top 0.406: R13.2 45.35,48.24 U$1.19
N$5
  pour Top (isolate 0.61, no thermals): 66.52,13.58 72.39,13.58 72.39,17.69 66.52,17.69
N$6
  Top 0.254: RJ1.P4 50.75,14.08 52.1,12.74 55.83,12.74 57.11,14.02 R5.1
  Top 0.61: R4.2 57.07,26.17 57.11,26.14 R5.1 L3.2 C15.2
N$7
  Top 0.61: C5.1 IC1.IN C4.1 C12.+
  Top 0.813: C12.+ 8.05,41.69 9.45,43.09 L2.2
N$8
  Top 0.305: R14.2 19.29,23.35 C10.+
N$9
  pour Top (isolate 0.61, no thermals): 66.68,10.37 72.39,10.37 72.39,11.97 66.68,11.97
N$10
  cutout Top: 35.05,31.23 30.86,31.23 30.86,31.15 35.05,31.15
N$11
  Top 0.305: U$2.P$26 33.22,38.11 Q3.2
  Top 0.406: Q3.2 C2.2
N$12
  Top 0.406: IC4.P$14 49.9,28.29 50.45,27.75 R6.2
N$13
  Top 0.305: U$2.P$25 33.21,37.46 Q3.1
  Top 0.406: Q3.1 C3.2
N$14
  Top 0.61: R1.2 C10.- 13.67,9.59 HEADPHONES.5
N$15
  cutout Top: 28.15,39.2 27.94,39.2 27.94,42.18 28.15,42.18
N$16
  cutout Top: 30.05,39.2 30.18,39.2 30.18,40.12 30.05,40.12
N$22
  Top 0.406: IC4.P$23 62.28,33.49 63.35,32.42 Q2.2
  Top 0.61: C21.1 Q2.2
N$23
  Top 0.406: IC4.P$24 62.27,34.14 63.35,35.22 Q2.1
  Top 0.61: C22.1 Q2.1
N$26
  Top 0.61: R15.2 67.23,18.96 Q5.4
N$29
  Top 0.406: IC4.P$1 48.8,38.76 C24.+
N$30
  Top 0.406: R17.1 45.09,4.96 RJ1.Y+
N$31
  Top 0.61: RJ1.G+ R19.2
N$34
  Top 0.386: U$2.P$8 L1.2
  Top 0.61: L1.2 C27.1 C9.+ IC1.OUT
N$40
  Top 0.254: U$2.P$5 23.69,36.81 24.79,37.91 24.79,47.47 R11.2 24.6,47.6
N$42
  Top 0.254: U$2.P$7 24.27,35.51 26.11,37.35 26.11,44.59 R9.2
N$44
  Top 0.386: U$2.P$16 30.48,31.61 31.01,32.14 C11.2
  Top 0.406: C11.2 C1.2
N$45
  Top 0.61: HEADPHONES.2 C13.- R8.2
N$46
  Top 0.386: U$2.P$14 20.11,30.96 19.62,31.45 19.62,32.8 19.21,32.8 L1.1
N$53
  Top 0.305: U$2.P$10 23.58,33.56 23.9,33.23 23.9,26.02 23.19,25.31 23.19,18.86 C13.+
N$54
  Top 0.305: U$2.P$18 27.31,32.91 26.54,32.14 26.54,29.17 27.87,27.85 C6.2
N$55
  Top 0.406: R26.1 C6.1 R25.2 C7.2 27.85,12.62 29.77,10.71 34.21,10.71 36.04,8.88 MIC.2
ROTARY_A
  Top 0.305: U$1.32 31.8,54.88 28.55,58.13 28.55,86.73 SW1.A
ROTARY_B
  Top 0.305: U$1.31 30.53,51.2 30.53,55.13 27.84,57.82 27.84,82.36 SW1.B
ROTARY_SW
  Top 0.305: U$1.33 27.99,51.2 27.99,53.25 23.17,58.08 23.17,76.36 20.25,79.28 10.09,79.28 7.57,81.8 SW1.SW+
RST
  Top 0.406: U$1.16 U$4.RST
SCK
  Top 0.305: IC4.P$8 46.77,32.19 42.6,36.36 42.6,46.11 41.96,46.75 U$1.23 43.23,51.2 43.23,55.76 44.5,57.03 U$4.SCK
SCL  (via drill 0.6 pad 1.27)
  Top 0.254: U$2.P$24 27.74,36.81 27.43,37.12 27.43,42.2 v31.24,46.01
  Top 0.406: v64.82,46.01 U$1.5
  Bottom 0.305: v31.24,46.01 v64.82,46.01
SDA  (via drill 0.6 pad 1.27)
  Top 0.254: U$2.P$23 27.45,36.16 26.77,36.84 26.77,42.48 28.86,44.56 v28.86,46.85
  Top 0.406: v67.36,46.85 U$1.3
  Bottom 0.305: v28.86,46.85 v67.36,46.85
SW1
  Top 0.305: U$1.36 26.72,53.5 22.46,57.77 22.46,67.5 S1.2
  Top 0.813: S1.1 S1.2
SW2
  Top 0.305: U$1.29 33.07,51.2 33.07,54.62 29.26,58.43 29.26,98.79 S2.2
  Top 0.813: S2.1 S2.2
TPIN_N
  Top 0.254: IC4.P$12 47.32,29.59 46.05,28.33 46.05,24.4 | RJ1.RD- 46.05,19.39 46.05,19.77 arc90 45.67,20.15 44.76,20.15 arc-90 44.38,20.54 44.38,20.58 arc-90 44.76,20.96 45.67,20.96 arc90 46.05,21.34 46.05,21.39 arc90 45.67,21.77 44.76,21.77 arc-90 44.38,22.15 44.38,22.19 arc-90 44.76,22.57 45.67,22.57 arc90 46.05,22.96 46.05,24.4 | R2.2 46.03,24.42 46.05,24.4
TPIN_P
  Top 0.254: IC4.P$13 47.31,28.94 46.51,28.14 46.51,26.15 | 46.51,26.15 46.51,19.57 47.55,18.53 51.28,18.53 52.02,17.79 RJ1.RD+ | R3.1 46.81,26.45 46.51,26.15
TPOUT_N
  Top 0.254: R5.2 55.02,24.14 | 55.02,24.14 55.02,16.57 55.86,15.73 55.86,13.7 55.55,13.4 53.57,13.4 53.29,13.68 RJ1.TD- | 55.02,24.14 55.02,28.57 55.39,28.94 IC4.P$16
TPOUT_P
  Top 0.254: 54.56,26.17 54.56,28.76 55.39,29.59 IC4.P$17 | R4.1 54.56,26.17 | 54.56,26.17 54.56,22.93 arc-90 54.18,22.54 52.89,22.54 arc90 52.51,22.16 52.51,22.15 arc90 52.89,21.77 54.18,21.77 arc-90 54.56,21.39 54.56,21.38 arc-90 54.18,21 52.89,21 arc90 52.51,20.62 52.51,20.61 arc90 52.89,20.23 54.18,20.23 arc-90 54.56,19.85 RJ1.TD+
VCC  (via drill 0.6 pad 1.93)
  Top 0.813: 69.77,22.2 Q5.2 | v11.36,55.15 L2.1
  Top 1.27: U$1.4 U$1.2 v69.9,55.15 v78.03,55.15
  Bottom 0.61: v11.36,55.15 v69.9,55.15
  Bottom 0.813: v78.03,32.85 v78.03,55.15
  pour Top (isolate 0.406, no thermals): 68.38,38.64 68.38,20.48 71.17,20.48 71.17,29.37 73.69,31.89 78.84,31.89 78.84,33.79 71.17,33.79 71.17,38.64